# Altium schematic sheet Power.SchDoc
size A; SheetNumber: 2; SheetTotal: 7
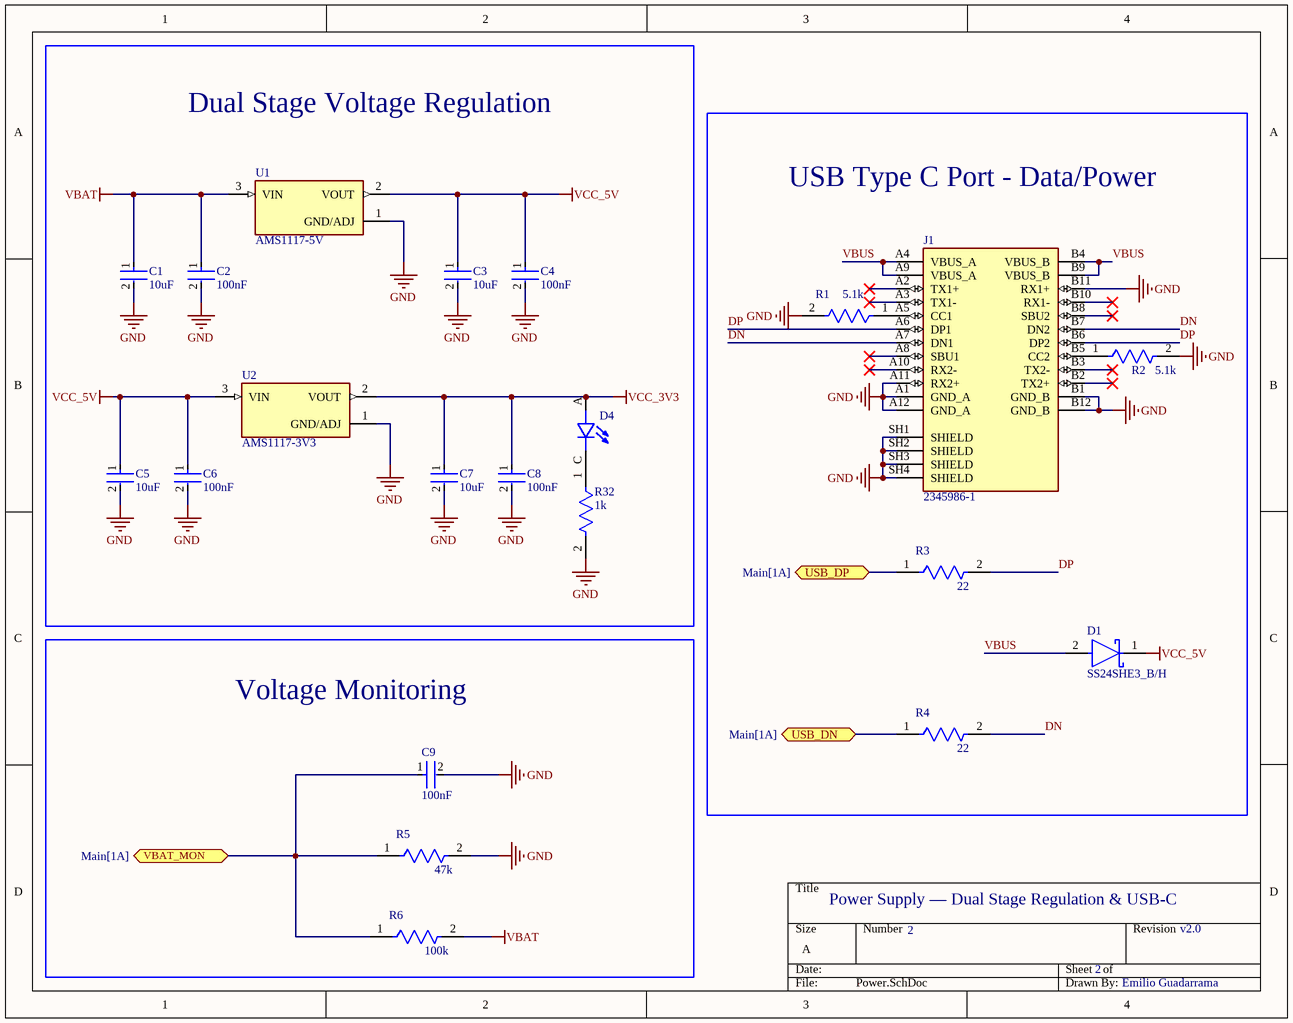
[diagram p0: Power.SchDoc]

## Parts
C1  10uF  [FP-C0805C-DN-MFG]
C2  100nF  [FP-C0805C-DN-MFG]
C3  10uF  [FP-C0805C-DN-MFG]
C4  100nF  [FP-C0805C-DN-MFG]
C5  10uF  [FP-C0805C-DN-MFG]
C6  100nF  [FP-C0805C-DN-MFG]
C7  10uF  [FP-C0805C-DN-MFG]
C8  100nF  [FP-C0805C-DN-MFG]
C9  100nF  [FP-C0805C-DN-MFG]
D1  SS24SHE3_B/H  [FP-95400-MFG]
D4  SML-LXT0805IW-TR  [LEDC2012X120N]  (value not drawn)
J1  2345986-1  [TE_2345986-1]
R1  5.1k  [FP-MCT0603-IPC_A]
R2  5.1k  [FP-MCT0603-IPC_A]
R3  22  [FP-MCT0603-IPC_A]
R4  22  [FP-MCT0603-IPC_A]
R5  47k  [FP-MCT0603-IPC_A]
R6  100k  [FP-MCT0603-IPC_A]
R32  1k  [FP-MCT0603-IPC_A]
U1  AMS1117-5V  [SOT229P700X180-4N]
U2  AMS1117-3V3  [SOT229P700X180-4N]

## Blocks framed on the sheet
Dual Stage Voltage Regulation: C1-C8 D4 R32 U1 U2

## Ports
USB_DN (bidir, see Main[1A]), USB_DP (bidir, see Main[1A]), VBAT_MON (bidir, see Main[1A])

## Nets
GND: C1.2 C2.2 C3.2 C4.2 C5.2 C6.2 C7.2 C8.2 C9.2 J1.A1(GND_A) J1.A11(RX2+) J1.A12(GND_A) J1.B1(GND_B) J1.B11(RX1+) J1.B12(GND_B) J1.SH1(SHIELD) J1.SH2(SHIELD) J1.SH3(SHIELD) J1.SH4(SHIELD) R1.2 R2.2 R5.2 R32.2 U1.1(GND/ADJ) U2.1(GND/ADJ)
VBAT: C1.1 C2.1 R6.2 U1.3(VIN)
VCC_3V3: C7.1 C8.1 D4.A U2.2(VOUT)
VCC_5V: C3.1 C4.1 C5.1 C6.1 D1.1(C) U1.2(VOUT) U2.3(VIN)
DN: J1.A7(DN1) J1.B7(DN2) R4.2
DP: J1.A6(DP1) J1.B6(DP2) R3.2
USB_DN: R4.1 ; port USB_DN
USB_DP: R3.1 ; port USB_DP
VBAT_MON: C9.1 R5.1 R6.1 ; port VBAT_MON
VBUS: D1.2(A) J1.A4(VBUS_A) J1.A9(VBUS_A) J1.B4(VBUS_B) J1.B9(VBUS_B)
NetD4_C: D4.C R32.1
NetJ1_A5: J1.A5(CC1) R1.1
NetJ1_B5: J1.B5(CC2) R2.1

Not connected (* = marked no-connect by the designer): J1 A2(TX1+)* A3(TX1-)* A8(SBU1)* A10(RX2-)* B2(TX2+)* B3(TX2-)* B8(SBU2)* B10(RX1-)*

## Notes on the sheet
- USB Type C Port - Data/Power
- Voltage Monitoring
- Power Supply — Dual Stage Regulation & USB-C
- 2
- v2.0
- Emilio Guadarrama

## Library data of the parts
C1-C9 = CMP-2007-00279-2: CAP CER 0.1UF 50V X7R 0805; Manufacturer Part Number: C0805C104K5RACTU; Manufacturer: KEMET; Value: 0.10 μF; Tolerance: 0.1; Temperature Coefficient: 30ppm/°C; Material: Ceramic; Device Class L2: Capacitors; Temperature Range Low: -55°C; Voltage Rating: 50 V; Digikey Description: CAP CER 0.1UF 50V X7R 0805; Category: Cap; ComponentLink2Description: Datasheet; Octopart: https://octopart.com/c0805c104k5ractu-kemet-143926; RoHS: TRUE; ComponentLink2URL: https://content.kemet.com/datasheets/KEM_C1003_C0G_SMD.pdf; Temperature Characteristic: X7R; Temperature: -55°C to +125°C; Height: 0.88mm; Temperature Range High: +125°C; Device Class L1: Passive Components; Automotive: No; Lead Free: Yes; Ipc Land Pattern Name: CAPC200125X78; Device Class L3: Ceramic Capacitors; Mouser Description: Cap Ceramic 0.1uF 50V X7R 10% SMD 2.0 x 1.2 mm 125 C Paper T/R; Capacitance: 0.10 μF; Package: C0805C-DN
D1 = CMP-02539-000047-1: DIODE SCHOTTKY 2A 40V DO-214AC; RoHS Compliant: Yes
D4 = SML-LXT0805IW-TR: LED;Red;11mcd;0.061In.Dia.;SMD;100mA;2V Vf;635nm;140deg;SMD;White Diffused;5V Vr | Lumex SML-LXT0805IW-TR; MF: Lumex Opto/Components; SnapEDA_Link: https://www.snapeda.com/parts/SML-LXT0805IW-TR/Lumex+Opto%252FComponents+Inc./view-part/?ref=snap; Package: 0805 Lumex; Value: *; MP: SML-LXT0805IW-TR; Check_prices: https://www.snapeda.com/parts/SML-LXT0805IW-TR/Lumex+Opto%252FComponents+Inc./view-part/?ref=eda
R1-R6 R32 = CMP-02407-011165-1: RES SMD 100 OHM 1% 1/8W 0603; Temperature Coefficient: 25ppm/°C; Resistance: 20kR; Power Rating: 125mW; Tolerance: 0.1%; Voltage Rating: 75V; Length: 1.55mm; Case Code (Imperial): 0603; Case/Package: 0603; Construction: Rectangular; Package Quantity: 1000; Number of Terminations: 2; Termination: SMD/SMT; Resistor Type: Thin Film; Features: Automotive AEC-Q200; Series: MCT 0603 - Precision; Max Operating Temperature: 155°C; Depth: 0.85mm; Max Power Dissipation: 125mW; Min Operating Temperature: -55°C; Width: 0.033inch; Case Code (Metric): 1608; Packaging: Tape and Reel; Weight: 6.7E-05oz; Military Standard: Not; Height: 0.022inch
U1 U2 = AMS1117-5.0: 1A LOW DROPOUT VOLTAGE REGULATOR; MF: ams; MP: AMS1117-5.0; Package: SOT-223 Seeed Technology; SnapEDA_Link: https://www.snapeda.com/parts/AMS1117-5.0/ams/view-part/?ref=snap; Check_prices: https://www.snapeda.com/parts/AMS1117-5.0/ams/view-part/?ref=eda; Availability: Not in stock; Value: *; Price: None
J1 = 2345986-1: Package: None; Price: None; Value: *; MP: 2345986-1; Availability: Unavailable